# Altium schematic sheet Digital.SchDoc: {Наименование}
size 420 x 297 mm; DocumentNumber: ПЛАС.ХХХХХХ.ХХХ ХХ; SheetNumber: {}; SheetTotal: {}; PageSetup: Record=PageOptions|CenterHorizontal=False|CenterVertical=False|PrintScale=0.95|XCorrection=0.00|YCorrection=0.00|PrintKind=1|BorderSize=5000000|LeftOffset=0|BottomOffset=0|Orientation=1|PaperLength=1000|PaperWidth=1000|Scale=100|PaperSource=15|PrintQuality=600|MediaType=1|DitherType=10|PaperKind=A4|PrintScaleMode=1; Rule: PcbType=ProtelPcb
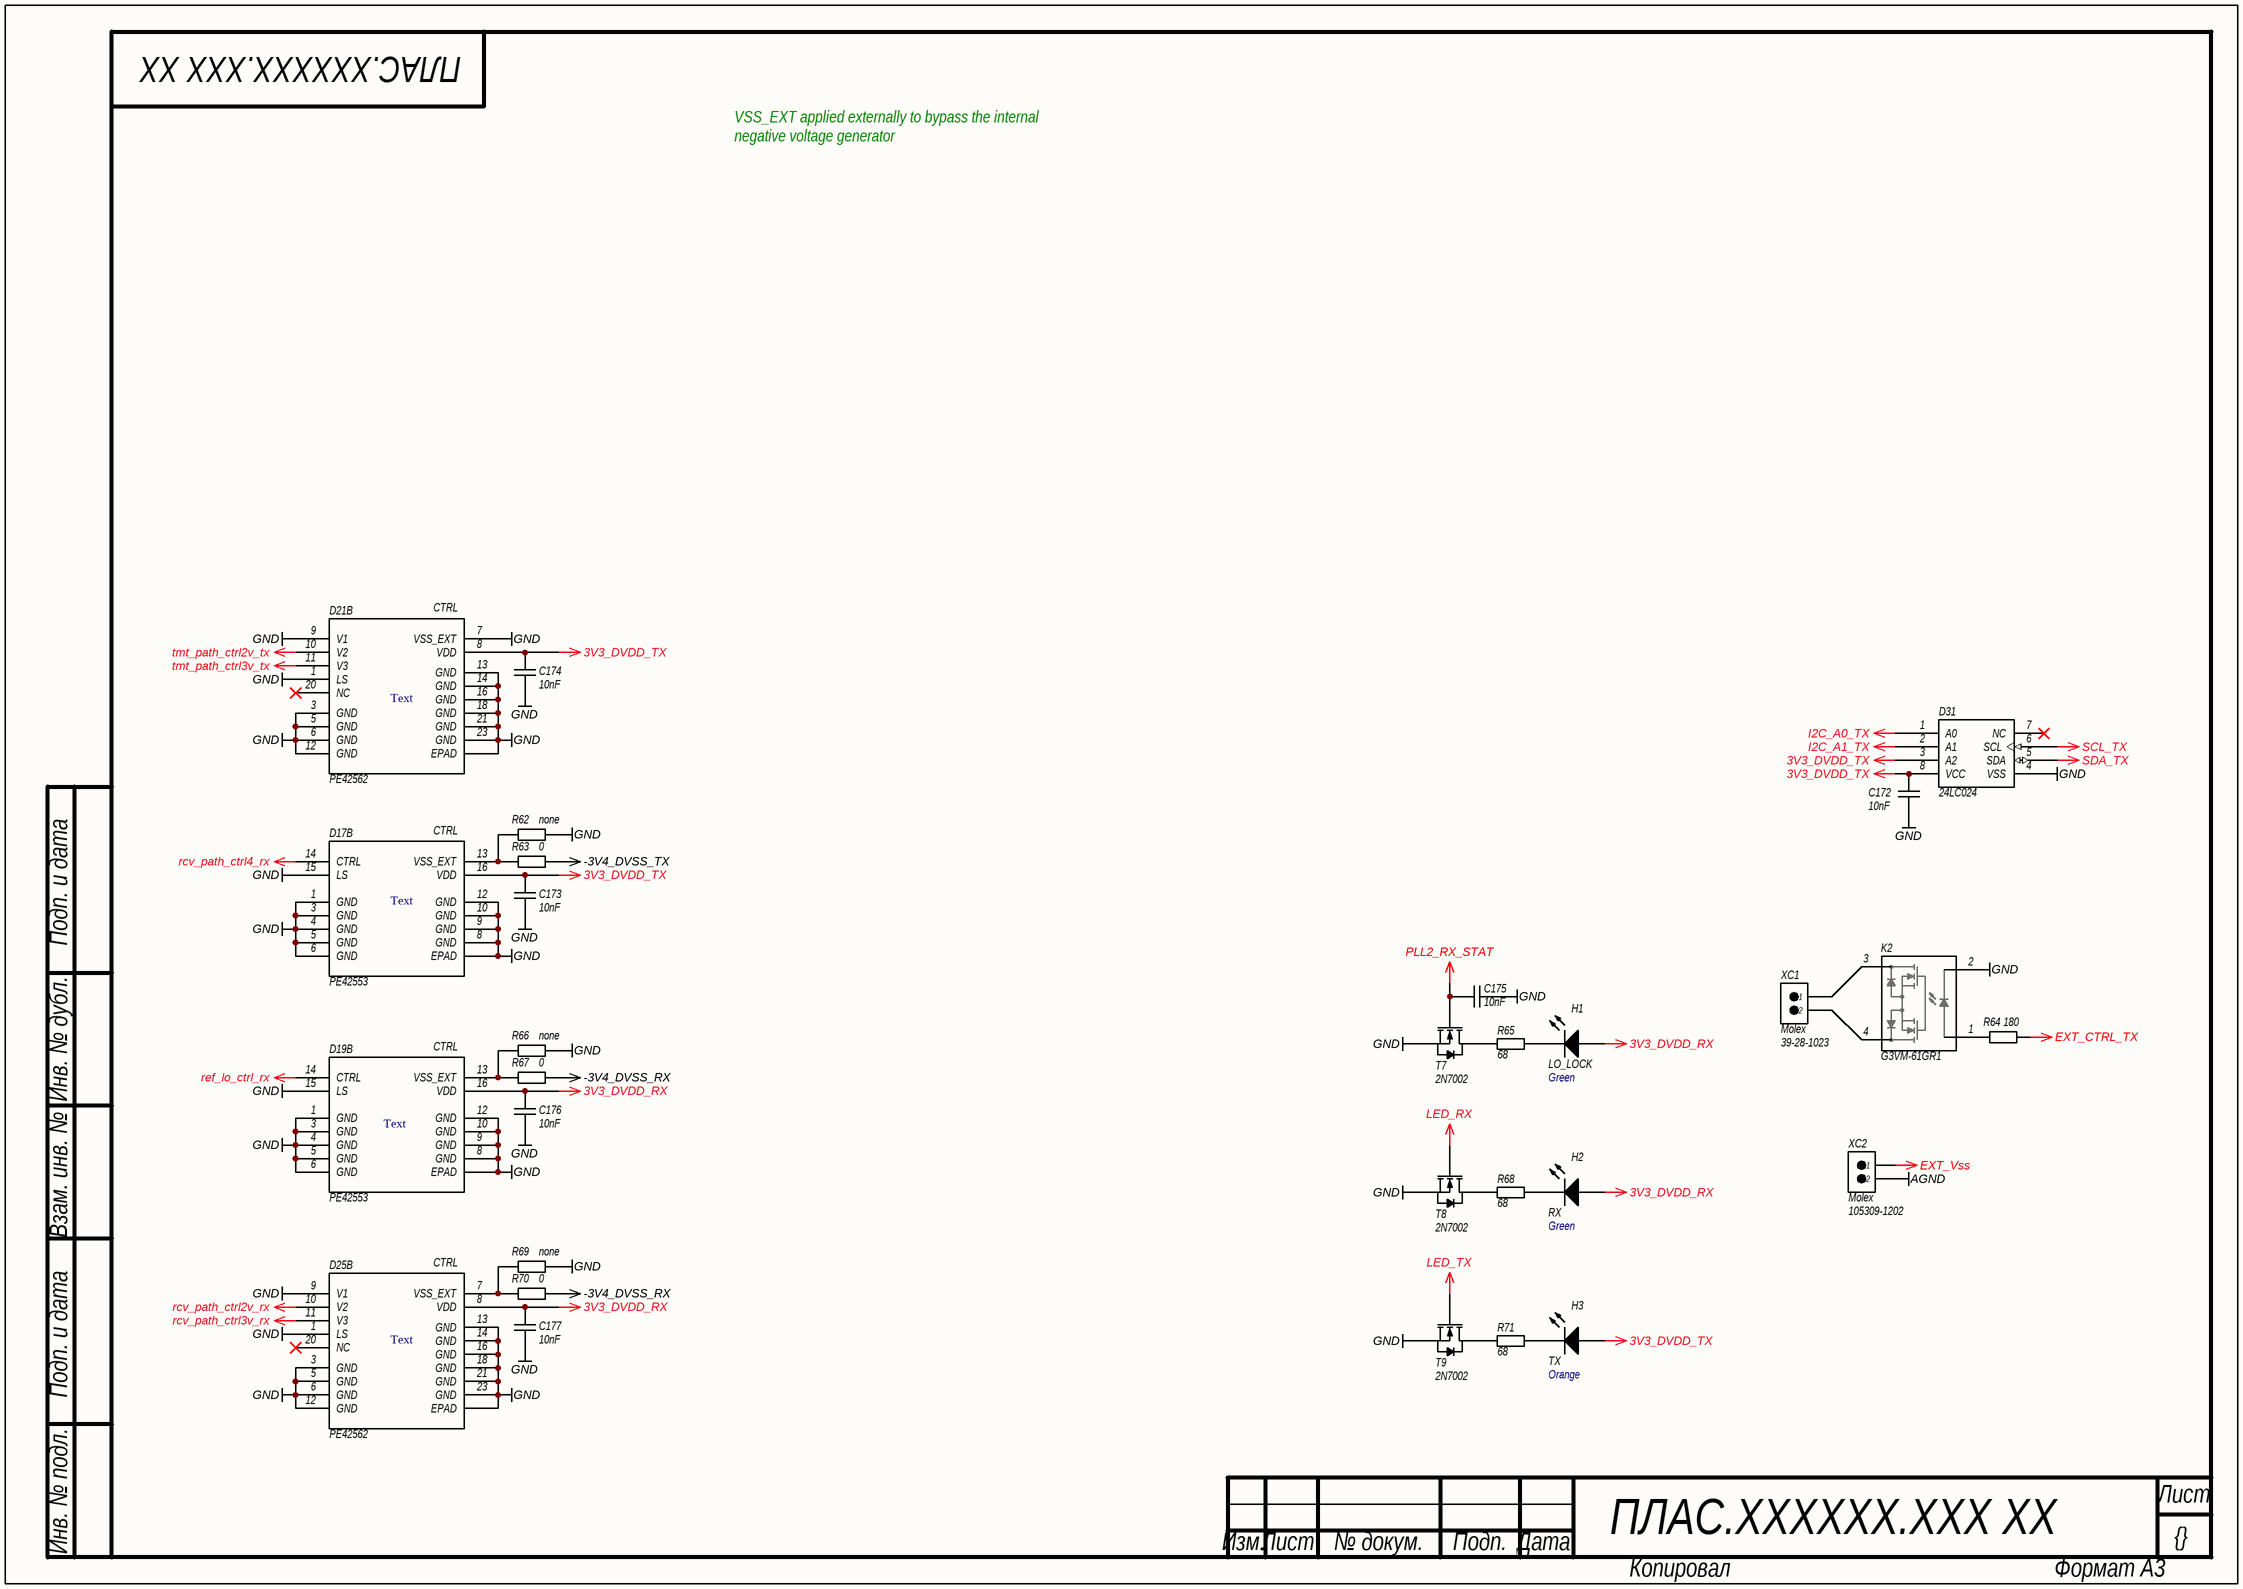
[diagram p0: Digital.SchDoc]

## Parts
C172  value 10nF  [C0402]  (hidden comment: CAP)
C173  value 10nF  [C0402]  (hidden comment: CAP)
C174  value 10nF  [C0402]  (hidden comment: CAP)
C175  value 10nF  [C0402]  (hidden comment: CAP)
C176  value 10nF  [C0402]  (hidden comment: CAP)
C177  value 10nF  [C0402]  (hidden comment: CAP)
D17  PE42553  [QFN-16]  (part B of 2)
D19  PE42553  [QFN-16]  (part B of 2)
D21  PE42562  [QFN-24]  (part B of 2)
D25  PE42562  [QFN-24]  (part B of 2)
D31  24LC024  [SOIC_SN8]
H1  LO_LOCK  Color: Green  [LED]
H2  RX  Color: Green  [LED]
H3  TX  Color: Orange  [LED]
K2  G3VM-61GR1  [G3VM-61]
R62  value none  [R0603]  (hidden comment: RES)
R63  value 0  [R0603]  (hidden comment: RES)
R64  value 180  [R0402]  (hidden comment: RES)
R65  value 68  [R0402]  (hidden comment: RES)
R66  value none  [R0603]  (hidden comment: RES)
R67  value 0  [R0603]  (hidden comment: RES)
R68  value 68  [R0402]  (hidden comment: RES)
R69  value none  [R0603]  (hidden comment: RES)
R70  value 0  [R0603]  (hidden comment: RES)
R71  value 68  [R0402]  (hidden comment: RES)
T7  2N7002  [SOT-23]
T8  2N7002  [SOT-23]
T9  2N7002  [SOT-23]
XC1  Manufacturer: Molex  P/N: 39-28-1023  [Mini-Fit Jr. Vertical Header]  (hidden comment: Mini-Fit Jr. Vertical Header)
XC2  Manufacturer: Molex  P/N: 105309-1202  [Nano-Fit Vertical Header]  (hidden comment: Nano-Fit Vertical Header)

## Nets
3V3_DVDD_RX: C176.1 C177.1 D19.16(VDD) D25.8(VDD) H1.2(A) H2.2(A)
3V3_DVDD_TX: C172.2 C173.1 C174.1 D17.16(VDD) D21.8(VDD) D31.3(A2) D31.8(VCC) H3.2(A)
-3V4_DVSS_RX: R67.1 R70.1
-3V4_DVSS_TX: R63.1
AGND: XC2.2
EXT_CTRL_TX: R64.2
EXT_Vss: XC2.1
GND: C172.1 C173.2 C174.2 C175.2 C176.2 C177.2 D17.1(GND) D17.3(GND) D17.4(GND) D17.5(GND) D17.6(GND) D17.8(GND) D17.9(GND) D17.10(GND) D17.12(GND) D17.15(LS) D17.17(EPAD) D19.1(GND) D19.3(GND) D19.4(GND) D19.5(GND) D19.6(GND) D19.8(GND) D19.9(GND) D19.10(GND) D19.12(GND) D19.15(LS) D19.17(EPAD) D21.1(LS) D21.3(GND) D21.5(GND) D21.6(GND) D21.7(VSS_EXT) D21.9(V1) D21.12(GND) D21.13(GND) D21.14(GND) D21.16(GND) D21.18(GND) D21.21(GND) D21.23(GND) D21.25(EPAD) D25.1(LS) D25.3(GND) D25.5(GND) D25.6(GND) D25.9(V1) D25.12(GND) D25.13(GND) D25.14(GND) D25.16(GND) D25.18(GND) D25.21(GND) D25.23(GND) D25.25(EPAD) D31.4(VSS) K2.2 R62.2 R66.2 R69.2 T7.2(S) T8.2(S) T9.2(S)
I2C_A0_TX: D31.1(A0)
I2C_A1_TX: D31.2(A1)
LED_RX: T8.1(G)
LED_TX: T9.1(G)
PLL2_RX_STAT: C175.1 T7.1(G)
rcv_path_ctrl2v_rx: D25.10(V2)
rcv_path_ctrl3v_rx: D25.11(V3)
rcv_path_ctrl4_rx: D17.14(CTRL)
ref_lo_ctrl_rx: D19.14(CTRL)
SCL_TX: D31.6(SCL)
SDA_TX: D31.5(SDA)
tmt_path_ctrl2v_tx: D21.10(V2)
tmt_path_ctrl3v_tx: D21.11(V3)
NetD17_13: D17.13(VSS_EXT) R62.1 R63.2
NetD19_13: D19.13(VSS_EXT) R66.1 R67.2
NetD25_7: D25.7(VSS_EXT) R69.1 R70.2
NetH1_1: H1.1(K) R65.2
NetH2_1: H2.1(K) R68.2
NetH3_1: H3.1(K) R71.1
NetK2_1: K2.1 R64.1
NetK2_3: K2.3 XC1.1
NetK2_4: K2.4 XC1.2
NetR65_1: R65.1 T7.3(D)
NetR68_1: R68.1 T8.3(D)
NetR71_2: R71.2 T9.3(D)

Not connected (* = marked no-connect by the designer): D21 20(NC)*; D25 20(NC)*; D31 7(NC)*

## Notes on the sheet
- VSS_EXT applied externally to bypass the internal
  negative voltage generator
- (near D21) Text
- (near D17) Text
- (near D19) Text
- (near D25) Text
- Подп. и дата
- Инв. № дубл.
- Взам. инв. №
- Инв. № подл.
- Лист
- Изм.
- № докум.
- Подп.
- Дата
- Копировал
- Формат А3
- (in symbol PE42562, part B) CTRL

## Library data of the parts
C172-C177 = CAP: SMD Capacitor; Manufacturer: Murata; Material: X7R; Tolerance: 10%; Voltage: 25V; Type: Ceramic Capacitor; P/N: GRM155R71E103KA01D
D17 D19 = PE42553: HaRPTM technology-enhanced absorptive SPDT; Manufacturer: Peregrine Technical Solutions; P/N: PE42553A-Z; Type: SPDT RF Switch; Name: PE42553; Package: 16-lead 3 × 3 mm QFN; Supplier 1: Digi-Key; Supplier Part Number 1: 1046-1137-1-ND
D21 D25 = PE42562: The PE42582 is a HaRP™ technology-enhanced absorptive SP6T RF switch; Manufacturer: Peregrine Technical Solutions; P/N: PE42562A-X; Name: PE42562; Package: 24-lead 4 × 4 × 0.85 mm QFN; Type: Absorptive SP6T RF switch
D31 = 24LC024: I2C EEPROM; Manufacturer: Microchip; Capacity: 2kbit; Max Clock: 400 kHz; Voltage: 2.5-5.5V; Name: 24LC024; Package: SOIC-8; Type: I2C EEPROM
H1 H2 = LED: CHIP LED LAMP; Manufacturer: Kingbright; Name: APHCM2012; P/N: APHCM2012CGCK-F01; Package: 2.0 x 1.25 mm SMD; Type: CHIP LED LAMP; Supplier 1: Digi-Key; Supplier Part Number 1: 754-1094-1-ND
H3 = LED: CHIP LED LAMP; Manufacturer: Kingbright; Name: APHCM2012; P/N: APHCM2012SECK-F01; Package: 2.0 x 1.25 mm SMD; Type: CHIP LED LAMP
K2 = G3VM-61GR1: MOS FET Relay; Manufacturer: Omron; Channel Resistance: 700 mOhm; Current: 1A; Voltage: 60V; Name: G3VM-61GR1; Package: SOT-23F; P/N: G3VM-61GR1; Supplier 1: Digi-Key; Supplier Part Number 1: Z4069CT-ND
R62 R63 R66 R67 R69 R70 = RES: SMD Resistor; Name: Chip SMD Resistor; Power: 0.1 Wt; Tolerance: 1%; P/N: ERJ-2GE0R00X; Temperature Range: -55…155°C
R64 = RES: SMD Resistor; Manufacturer: Panasonic Electronic Components; Name: Chip SMD Resistor; Power: 0.063 Wt; Tolerance: 1%; P/N: ERJ-2RKF1800X; Temperature Range: -55…155°C
R65 R68 R71 = RES: SMD Resistor; Name: Chip SMD Resistor; Power: 0.062 Wt; Tolerance: 5%; P/N: ERJ-2GEJ680X; Temperature Range: -55…155°C
T7-T9 = 2N7002: N-Channel MOSFET 2N7002; Channel Resistance: 5Ohm; Current: 300mA; Power Dissipation: 0.83W; Voltage: 60V; Name: 2N7002; Type: SOT-23; Package: SOT-23
XC1 = Mini-Fit Jr. Vertical Header: 4.20mm Pitch, Dual Row, 2 Circuits, without Snap-in Plastic Peg PCB Lock; Mate With Series: 5557; Name: Mini-Fit Jr. Vertical Header; Series: 5566; Type: Mini-Fit Jr. Vertical Header, 4.20mm Pitch, Dual Row, 2 Circuits, without Snap-in Plastic Peg PCB Lock; Mate With P/N: 39-01-2020
XC2 = Nano-Fit Power Connector: Through Hole, 2.50mm Pitch, Single Row, 2 Circuits; Mate With P/N: 105307-1202; Mate With Series: 105307; Name: Nano-Fit Vertical Header; Series: 105309; Type: Vertical Header, Through Hole, 2.50mm Pitch